# EasyEDA schematic SCH_Arduino_Nano_ESP32_CapibaraZero_2024-09-10.json

## Sheets
1 MainScheme: TITLE: CapibaraZero_Arduino_Nano_ESP32; REV: 1.0; Date: 2024-04-09; Sheet: 1/1; Drawn By: Andrea Canale; Company: CapibaraZero
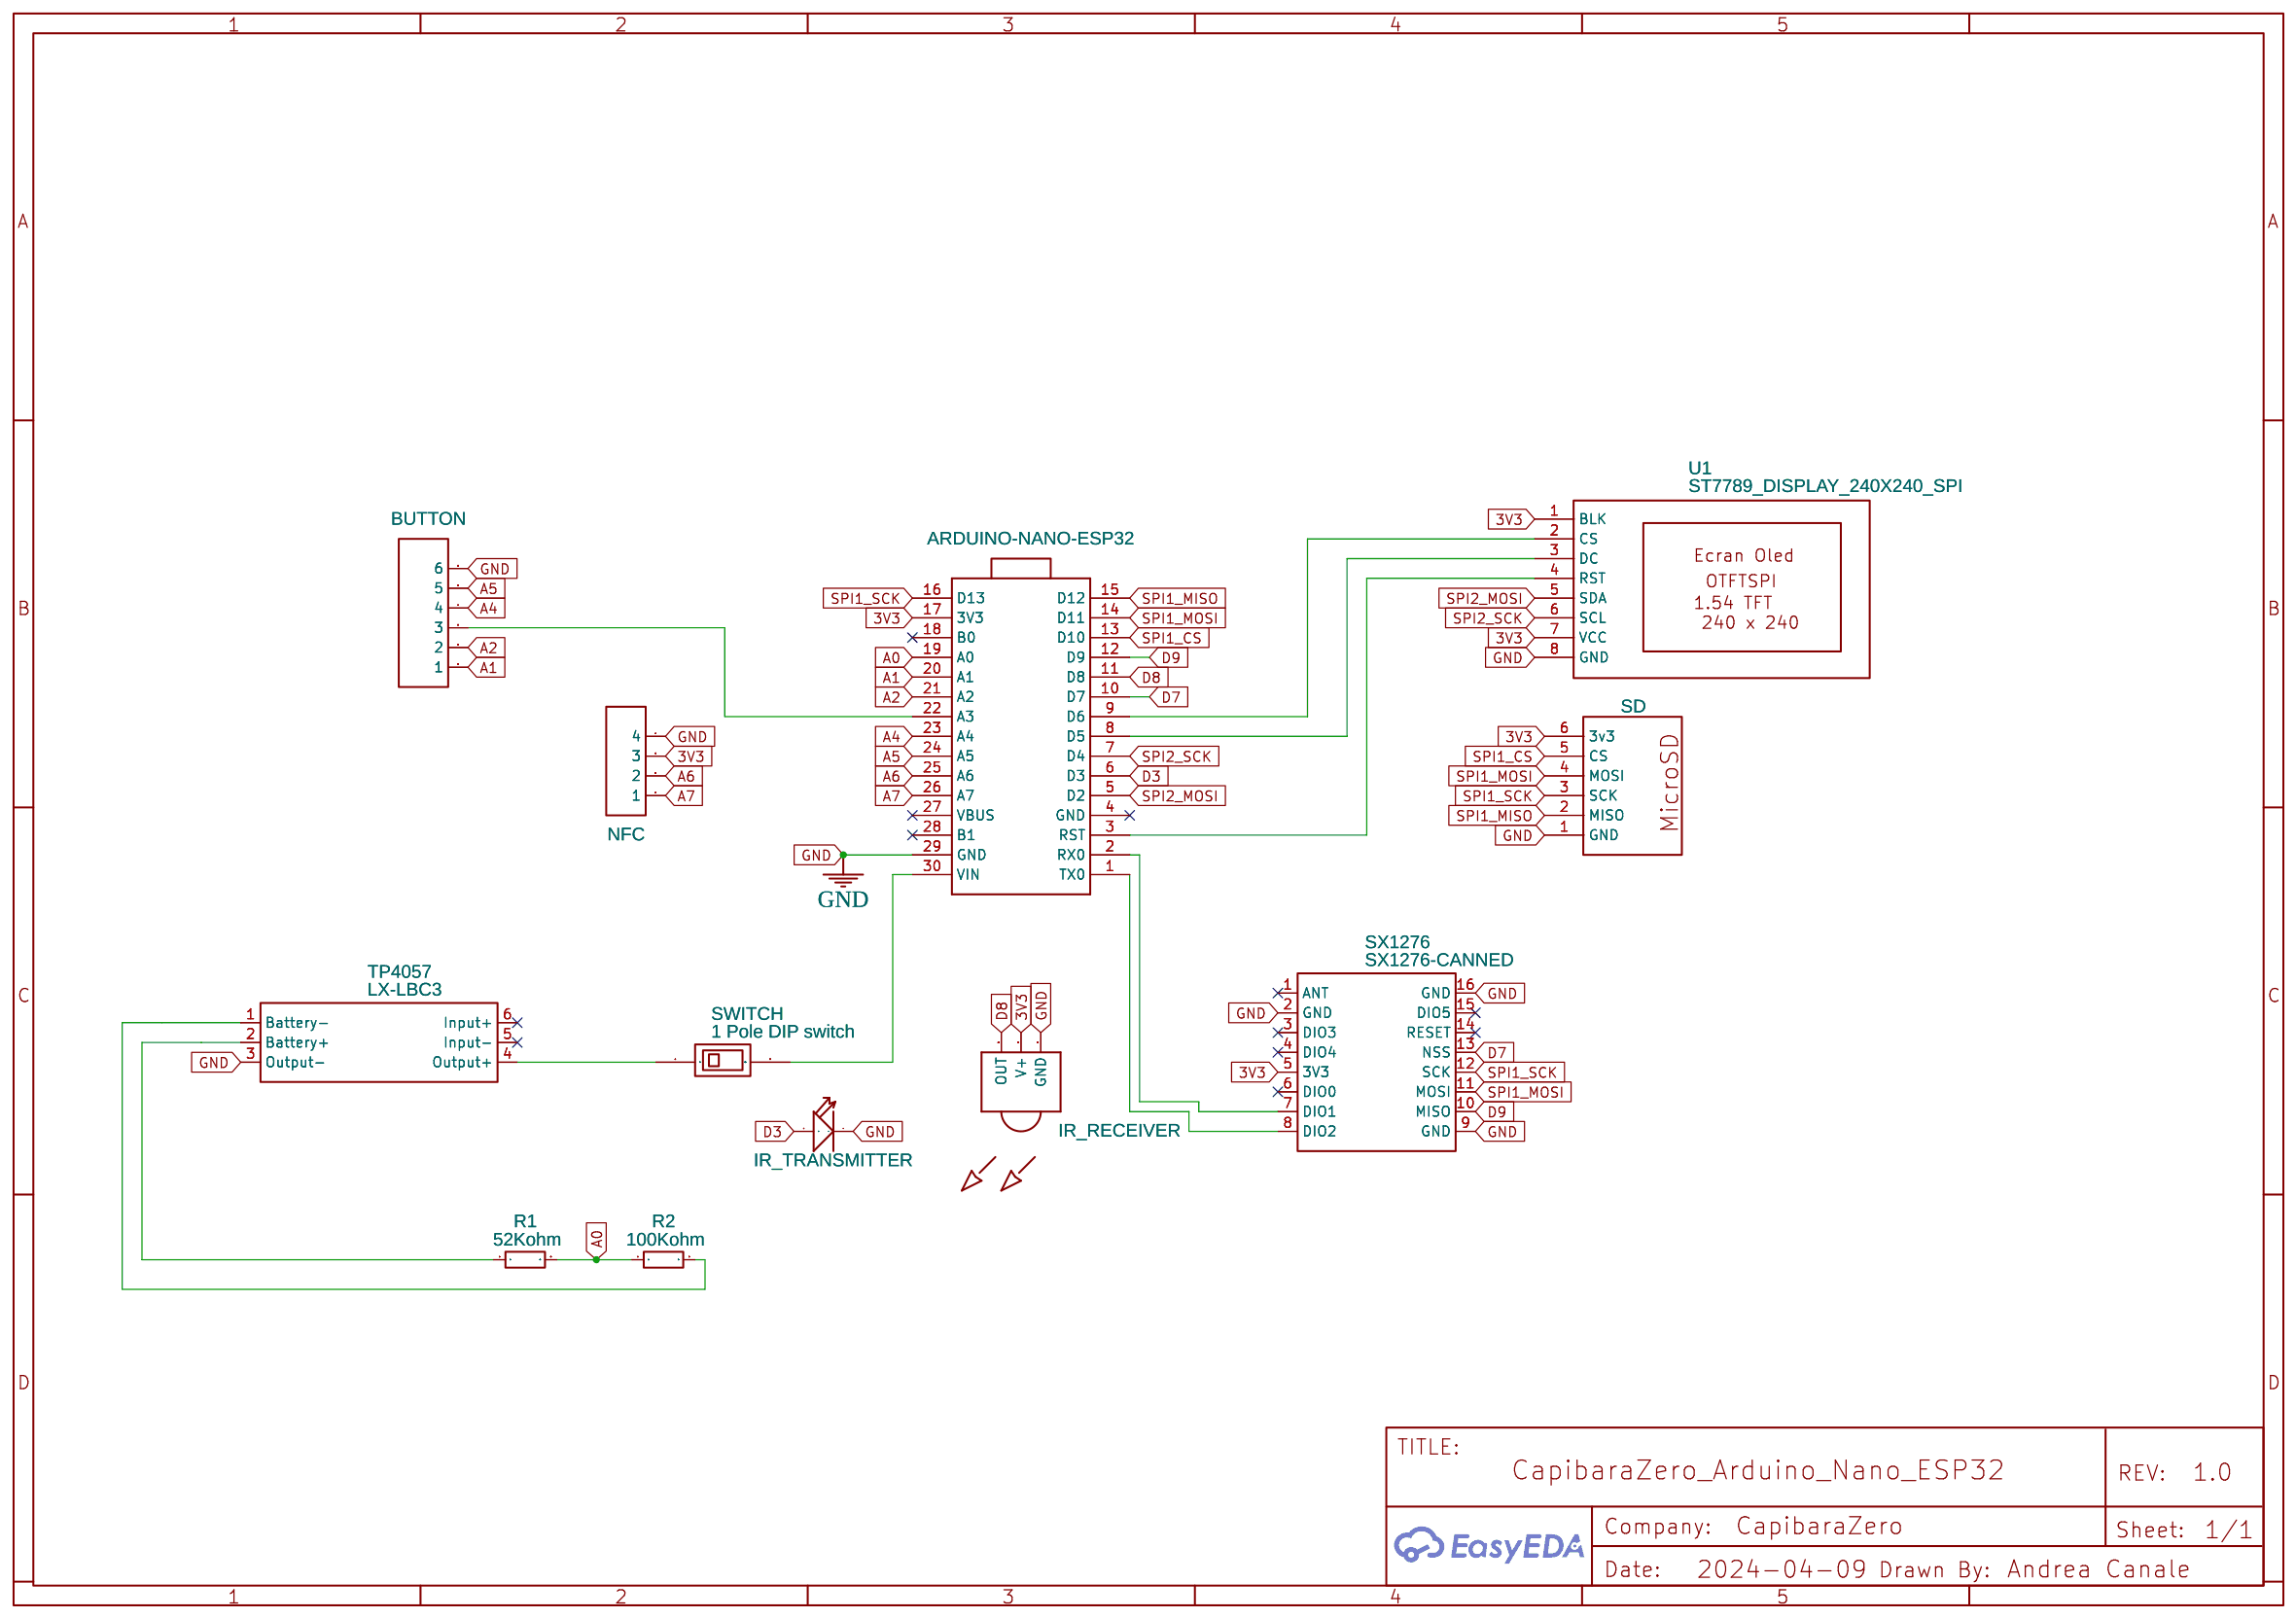
[diagram p0: MainScheme]
2 Navigation_board: TITLE: Navigation Board; Date: 2024-02-09; Drawn By: vivanco11.ac; Company: Your Company
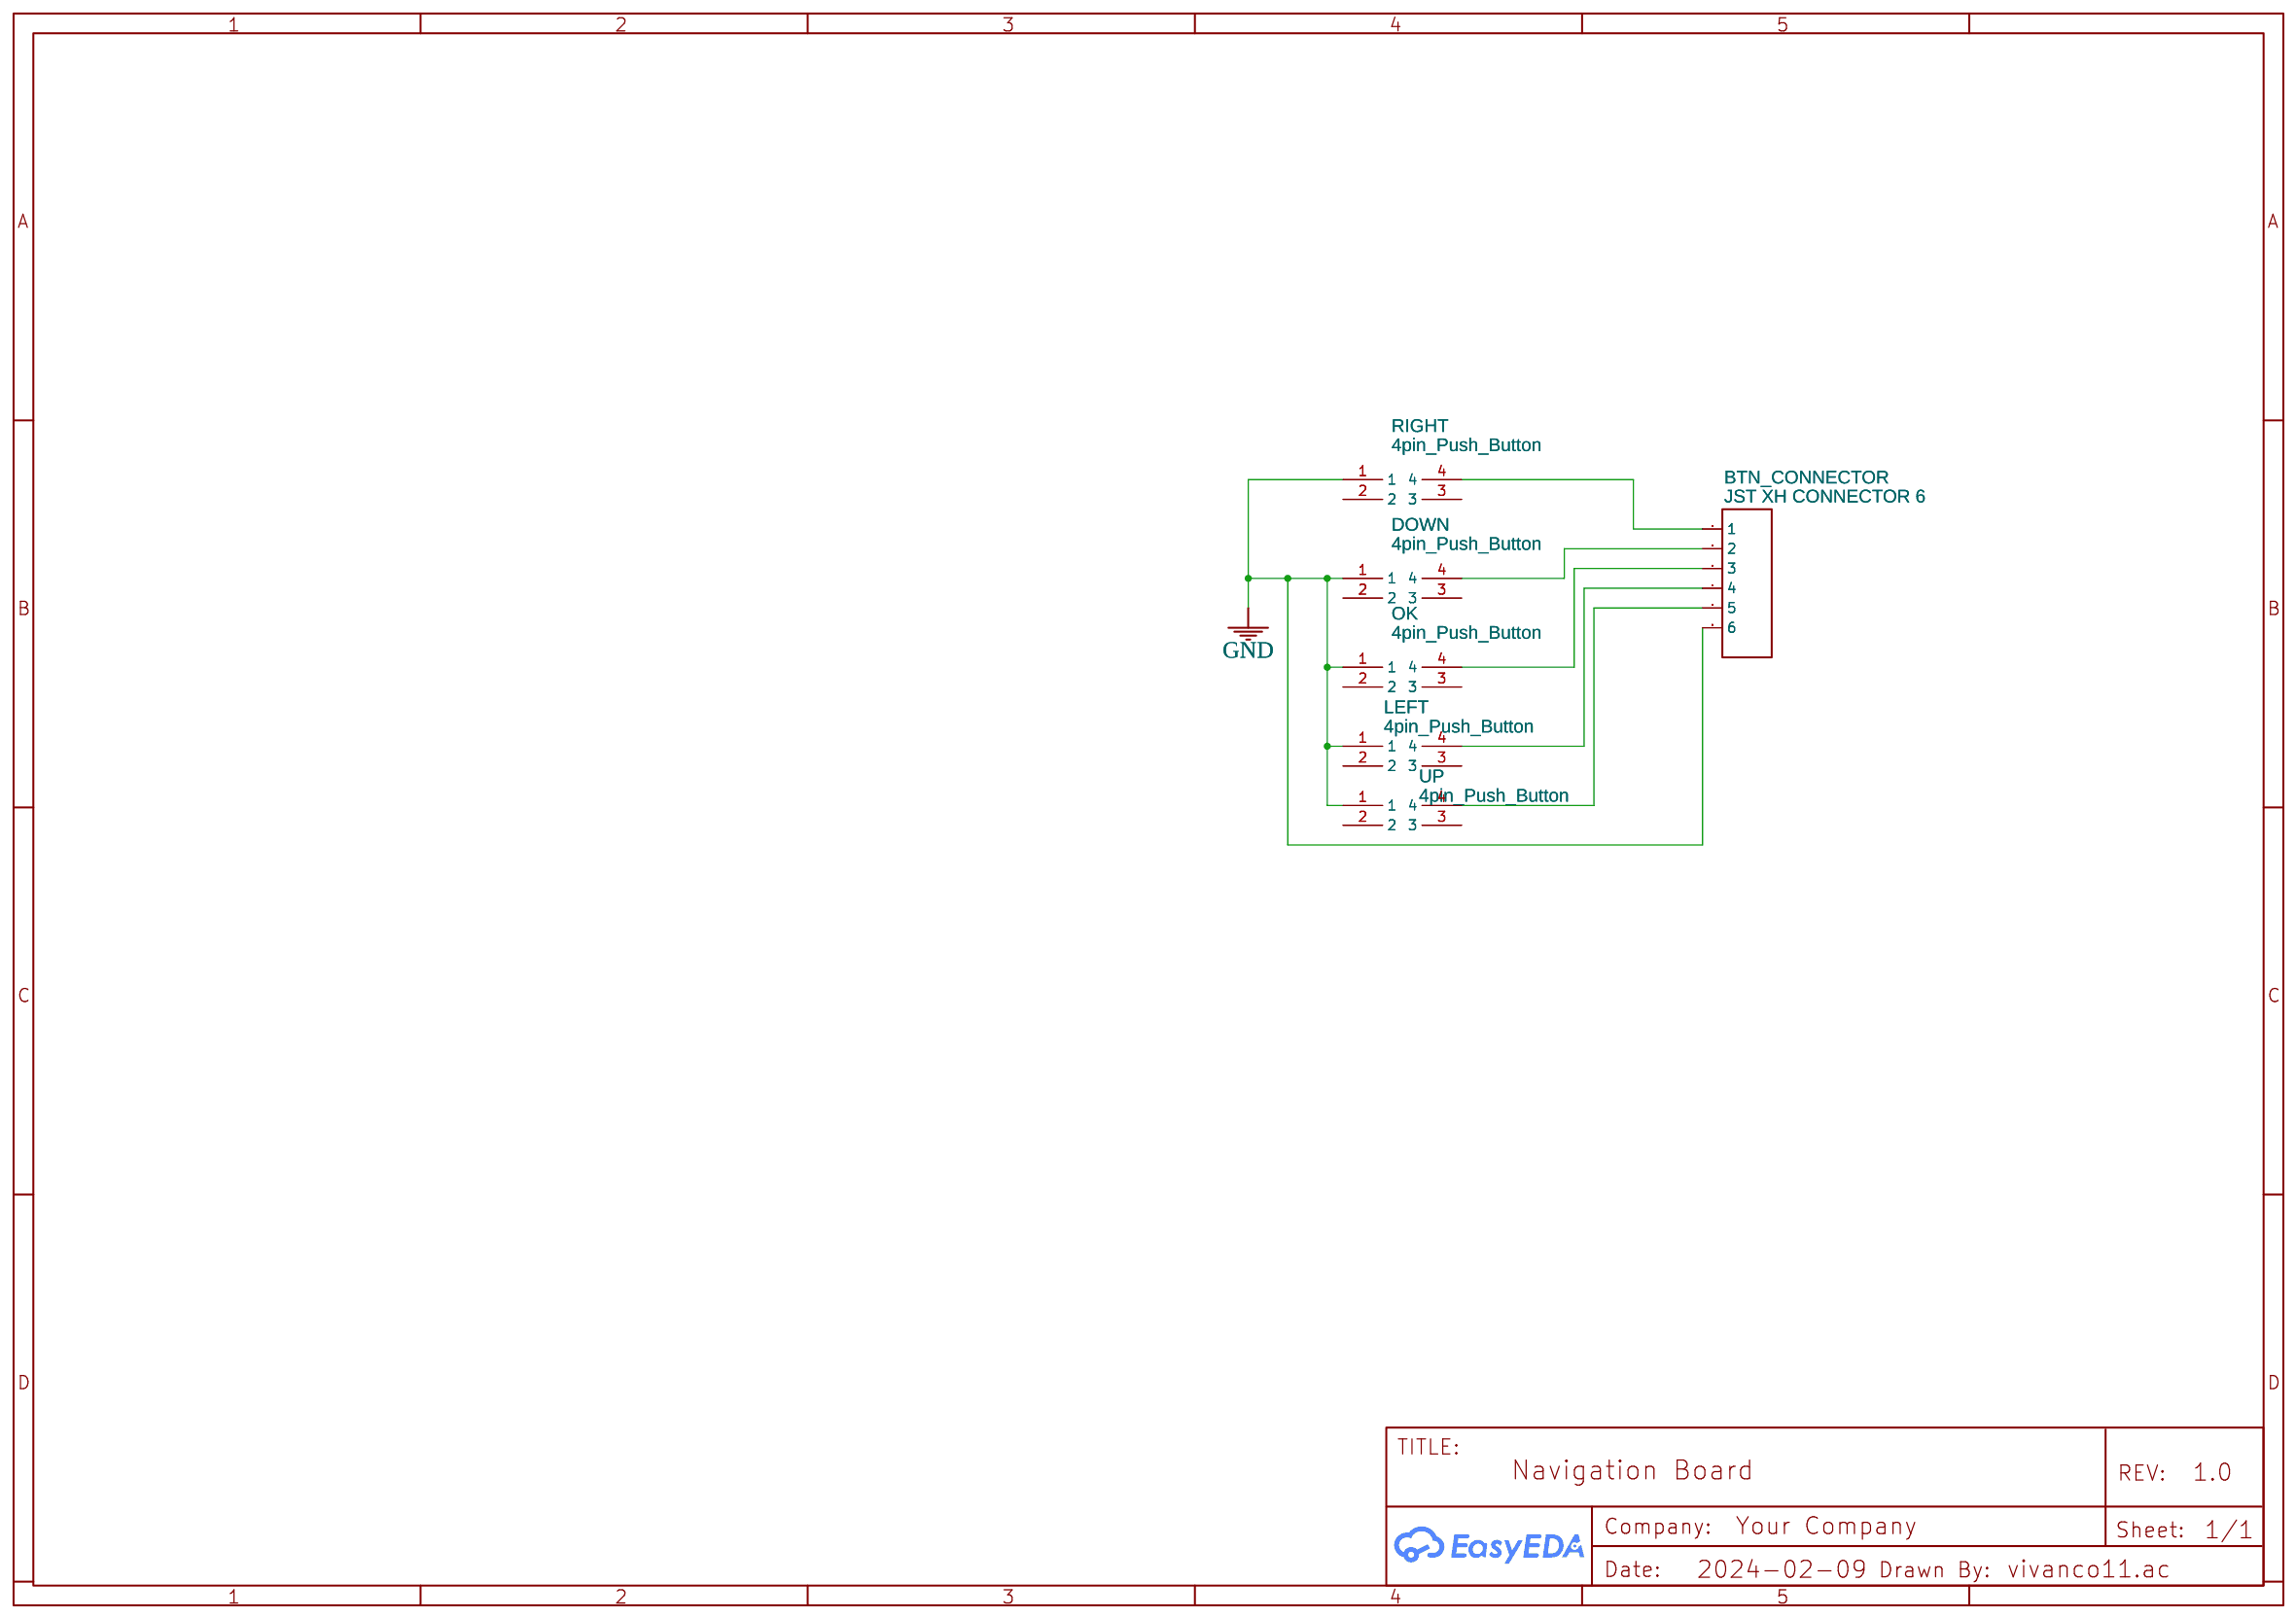
[diagram p1: Navigation_board]

## Parts
sheet MainScheme
ARDUINO-NANO-ESP32  ARDUINO-NANO-ESP32  [ARDUINO-NANO-V3.0]
BUTTON  BTN Connector  [JST XH 6 PIN]
IR_RECEIVER  IR Receiver  [TSOP18XX]
IR_TRANSMITTER  DIP-IR-LED-940NM(2P-D5MM)  [LED2-2.54-D5.0MM]
NFC  NFC Connector  [JST_XH_4X2.54MM]
R1  52Kohm  [RESISTOR]
R2  100Kohm  [RESISTOR]
SD  MicroSDSPI  [MICROSD SOCKET]
SWITCH  1 Pole DIP switch  [1 POSITION DIP SWITCH]
SX1276  SX1276-CANNED  [SX1276-CANNED]
TP4057  LX-LBC3  [LX-LBC3]
U1  ST7789_DISPLAY_240X240_SPI  [1.54_DISPLAY_SPI]
sheet Navigation_board
BTN_CONNECTOR  JST XH CONNECTOR 6  [JST XH 6 PIN]
DOWN  4pin_Push_Button  [PUSH BUTTON 4 PIN DIP]
LEFT  4pin_Push_Button  [PUSH BUTTON 4 PIN DIP]
OK  4pin_Push_Button  [PUSH BUTTON 4 PIN DIP]
RIGHT  4pin_Push_Button  [PUSH BUTTON 4 PIN DIP]
UP  4pin_Push_Button  [PUSH BUTTON 4 PIN DIP]

## Library data of the parts
ARDUINO-NANO-ESP32 = ARDUINO-NANO-ESP32: sourceId: VqeOavtdN; Contributor: vivanco11.ac; Manufacturer: Arduino
BTN_CONNECTOR BUTTON = JST XH CONNECTOR 6: Manufacturer Part: JST_XH CONNECTOR; link: https://nl.aliexpress.com/item/50-sets-Kit-in-doos-2-p-3-p-4-pin-2-54mm-Pitch-Terminal-Behuizing/32681086028.html?spm=a2g0s.9042311.0.0.I0g15Z; Contributor: vivanco11.ac
IR_RECEIVER = IR TRANSMITTER: sourceId: vOawSeXH3; Contributor: vivanco11.ac
IR_TRANSMITTER = DIP-IR-LED-940NM(2P-D5MM): DIP IR LED 940nm; Supplier Part: 304090159; Supplier: SeeedStudio; Manufacturer Part: IR523B-W60W1; sourceId: iIBTN5nFX; Contributor: vivanco11.ac
NFC = JST XH CONNECTOR 4: Manufacturer Part: JST_XH CONNECTOR; link: https://nl.aliexpress.com/item/50-sets-Kit-in-doos-2-p-3-p-4-pin-2-54mm-Pitch-Terminal-Behuizing/32681086028.html?spm=a2g0s.9042311.0.0.I0g15Z; Contributor: vivanco11.ac
R1 R2 = Resistor Normal: Supplier: LCSC; Supplier Part: X16151710; Manufacturer: ResistorToday; Manufacturer Part: EWWR0001J20R0T9; Contributor: vivanco11.ac
SD = MicroSDSPI: catid: 20; Contributor: vivanco11.ac; sim: true
SWITCH = 1 Pole DIP switch: Contributor: vivanco11.ac
SX1276 = SX1276-CANNED: Manufacturer: G-NiceRF; Manufacturer Part: LoRa1276-C1; Supplier: Banggood; Supplier Part: Unknown; link: https://uk.banggood.com/LoRa1276-C1-SX1276-868MHz-LoRa-Module-Remote-Spread-Spectrum-Wireless-Module-20dBm-100mW-3-5KM-p-1416393.html?gmcCountry=GB¤cy=GBP&createTmp=1&utm_source=googleshopping&utm_medium=cpc_bgcs&utm_content=garman&utm_campaign=pla-gbg-ele-pc&gclid=EAIaIQobChMIouzku5XS4gIVipTtCh1cvgo9EAYYByABEgJIPfD_BwE&cur_warehouse=CN; Contributor: vivanco11.ac
TP4057 = LX-LBC3: Contributor: vivanco11.ac
U1 = ST7789_DISPLAY_240X240_SPI: Contributor: vivanco11.ac
DOWN LEFT OK RIGHT UP = 4pin_Push_Button: Contributor: vivanco11.ac

## Nets
3V3: ARDUINO-NANO-ESP32.17(3V3) IR_RECEIVER.VCC(V+) NFC.3 SD.6(3v3) SX1276.5(3V3) U1.1(BLK) U1.7(VCC)
GND: ARDUINO-NANO-ESP32.29(GND) BTN_CONNECTOR.6 BUTTON.6 DOWN.1 IR_RECEIVER.GND IR_TRANSMITTER.- LEFT.1 NFC.4 OK.1 RIGHT.1 SD.1(GND) SX1276.2(GND) SX1276.9(GND) SX1276.16(GND) TP4057.3(Output-) U1.8(GND) UP.1
A0: ARDUINO-NANO-ESP32.19(A0) R1.2 R2.1
A1: ARDUINO-NANO-ESP32.20(A1) BUTTON.1
A2: ARDUINO-NANO-ESP32.21(A2) BUTTON.2
A4: ARDUINO-NANO-ESP32.23(A4) BUTTON.4
A5: ARDUINO-NANO-ESP32.24(A5) BUTTON.5
A6: ARDUINO-NANO-ESP32.25(A6) NFC.2
A7: ARDUINO-NANO-ESP32.26(A7) NFC.1
D3: ARDUINO-NANO-ESP32.6(D3) IR_TRANSMITTER.+
D7: ARDUINO-NANO-ESP32.10(D7) SX1276.13(NSS)
D8: ARDUINO-NANO-ESP32.11(D8) IR_RECEIVER.OUT
D9: ARDUINO-NANO-ESP32.12(D9) SX1276.10(MISO)
SPI1_CS: ARDUINO-NANO-ESP32.13(D10) SD.5(CS)
SPI1_MISO: ARDUINO-NANO-ESP32.15(D12) SD.2(MISO)
SPI1_MOSI: ARDUINO-NANO-ESP32.14(D11) SD.4(MOSI) SX1276.11(MOSI)
SPI1_SCK: ARDUINO-NANO-ESP32.16(D13) SD.3(SCK) SX1276.12(SCK)
SPI2_MOSI: ARDUINO-NANO-ESP32.5(D2) U1.5(SDA)
SPI2_SCK: ARDUINO-NANO-ESP32.7(D4) U1.6(SCL)
Net-(ARDUINO-NANO-ESP32-1): ARDUINO-NANO-ESP32.1(TX0) SX1276.8(DIO2)
Net-(ARDUINO-NANO-ESP32-2): ARDUINO-NANO-ESP32.2(RX0) SX1276.7(DIO1)
Net-(ARDUINO-NANO-ESP32-3): ARDUINO-NANO-ESP32.3(RST) U1.4(RST)
Net-(ARDUINO-NANO-ESP32-8): ARDUINO-NANO-ESP32.8(D5) U1.3(DC)
Net-(ARDUINO-NANO-ESP32-9): ARDUINO-NANO-ESP32.9(D6) U1.2(CS)
Net-(ARDUINO-NANO-ESP32-22): ARDUINO-NANO-ESP32.22(A3) BUTTON.3
Net-(ARDUINO-NANO-ESP32-30): ARDUINO-NANO-ESP32.30(VIN) SWITCH.2(OUT)
Net-(BTN_CONNECTOR-1): BTN_CONNECTOR.1 RIGHT.4
Net-(BTN_CONNECTOR-2): BTN_CONNECTOR.2 DOWN.4
Net-(BTN_CONNECTOR-3): BTN_CONNECTOR.3 OK.4
Net-(BTN_CONNECTOR-4): BTN_CONNECTOR.4 LEFT.4
Net-(BTN_CONNECTOR-5): BTN_CONNECTOR.5 UP.4
Net-(R1-1): R1.1 TP4057.2(Battery+)
Net-(R2-2): R2.2 TP4057.1(Battery-)
Net-(SWITCH-1): SWITCH.1(IN) TP4057.4(Output+)

Not connected (* = marked no-connect by the designer): ARDUINO-NANO-ESP32 4(GND)* 18(B0)* 27(VBUS)* 28(B1)*; DOWN 2 3; LEFT 2 3; OK 2 3; RIGHT 2 3; SX1276 1(ANT)* 3(DIO3)* 4(DIO4)* 6(DIO0)* 14(RESET)* 15(DIO5)*; TP4057 5(Input-)* 6(Input+)*; UP 2 3
